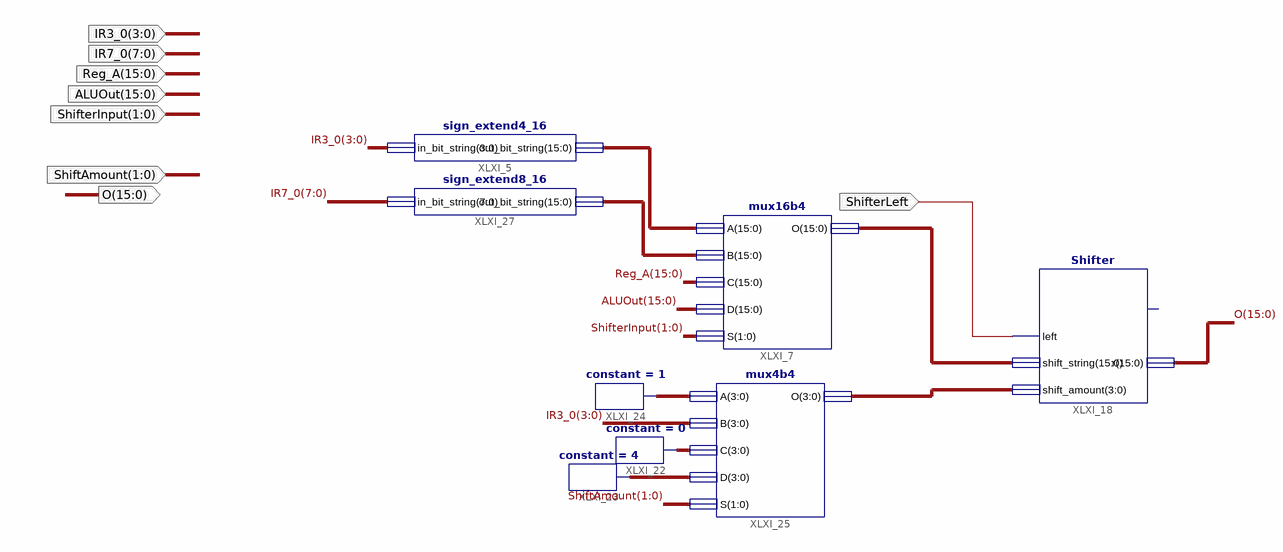
[diagram p0: schematic sheet 1]
// Xilinx ISE schematic Extend_Shift_Unit.sch (spartan3e) as structural Verilog: 8 symbols, 8 ports
module Extend_Shift_Unit (
  input  [3:0] IR3_0,
  input  [7:0] IR7_0,
  input  [15:0] Reg_A,
  input  [15:0] ALUOut,
  input  [1:0] ShifterInput,
  input  [1:0] ShiftAmount,
  input  ShifterLeft,
  output [15:0] O
);

  wire [3:0] XLXN_54, XLXN_55, XLXN_66, XLXN_75;
  wire [15:0] XLXN_2, XLXN_76, XLXN_78;

  mux16b4 XLXI_7 (.A(XLXN_2), .B(XLXN_78), .C(Reg_A), .D(ALUOut), .S(ShifterInput), .O(XLXN_76));
  sign_extend4_16 XLXI_5 (.in_bit_string(IR3_0), .out_bit_string(XLXN_2));
  constant #(.CValue("1")) XLXI_24 (.O(XLXN_66));
  constant #(.CValue("0")) XLXI_22 (.O(XLXN_54));
  constant #(.CValue("4")) XLXI_23 (.O(XLXN_55));
  mux4b4 XLXI_25 (.A(XLXN_66), .B(IR3_0), .C(XLXN_54), .D(XLXN_55), .S(ShiftAmount), .O(XLXN_75));
  sign_extend8_16 XLXI_27 (.in_bit_string(IR7_0), .out_bit_string(XLXN_78));
  Shifter XLXI_18 (.left(ShifterLeft), .shift_string(XLXN_76), .shift_amount(XLXN_75), .r(O));
endmodule
